# Altium schematic sheet 22.SchDoc
size 297 x 209 mm
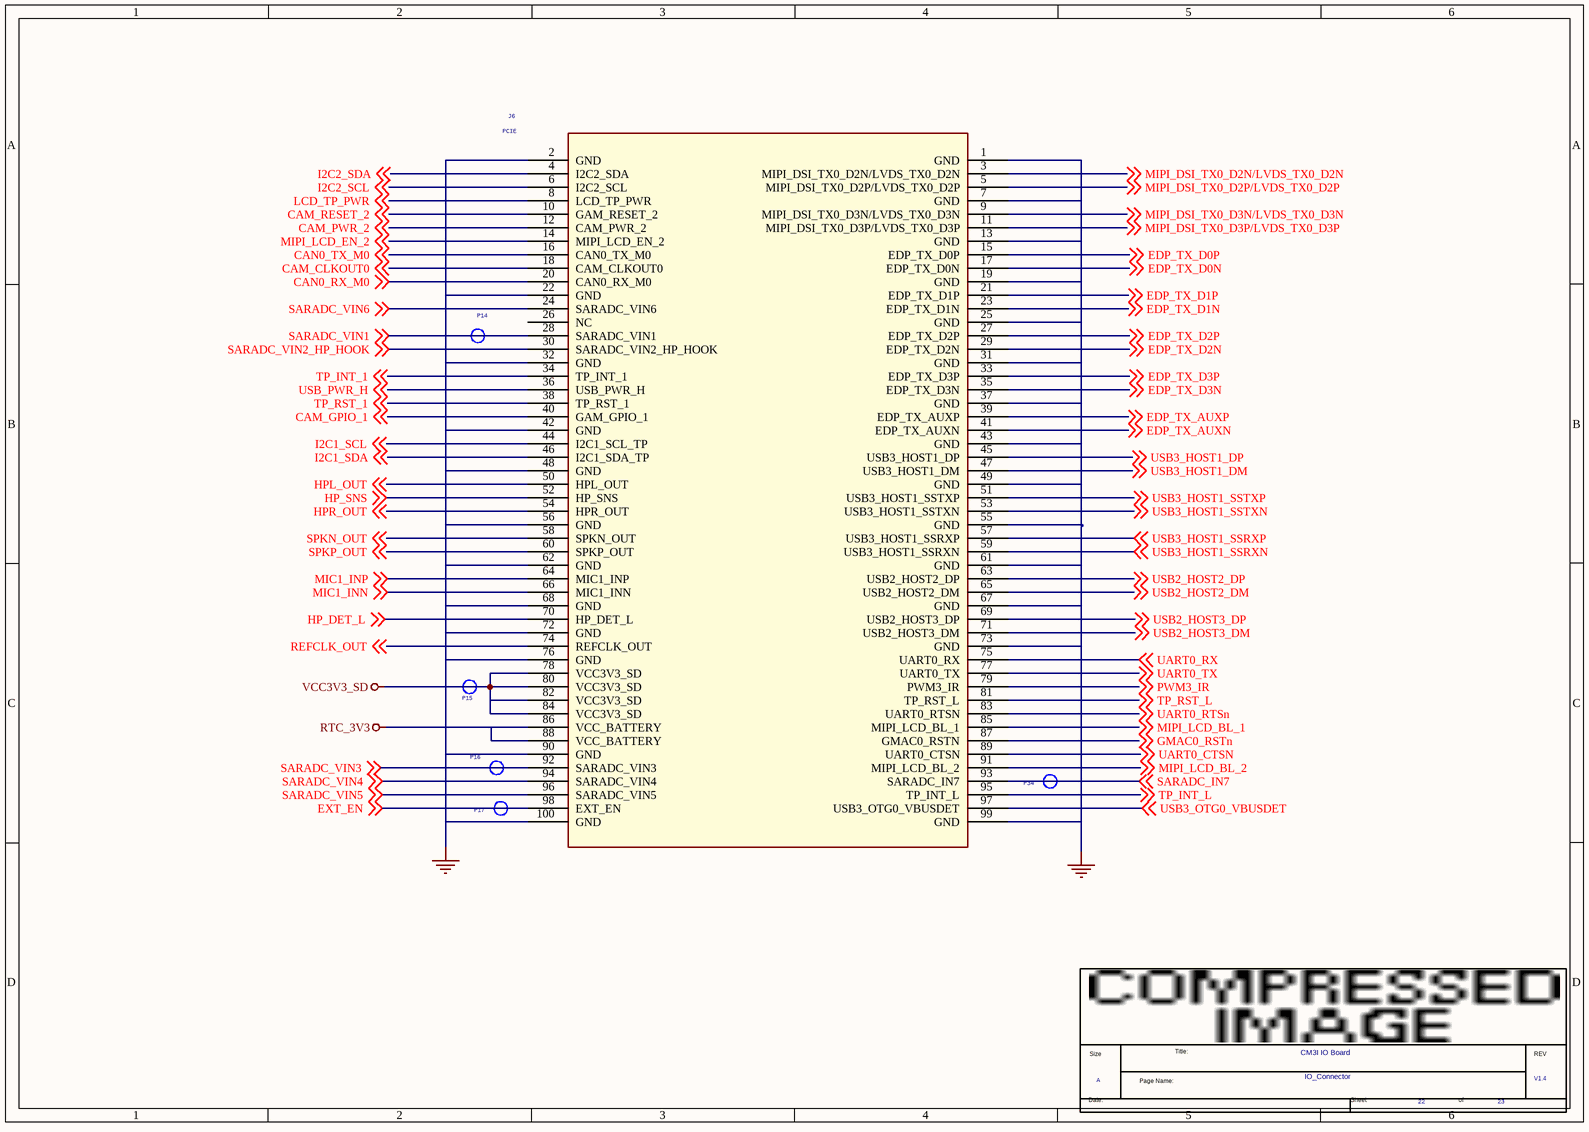
[diagram p0: 22.SchDoc]

## Parts
*  Page Count: 23  Page Number: 22  Page Size: A  Title: CM3I IO Board  RevCode: V1.4  Doc: IO_Connector  (hidden comment: radxa_1010)  (graphical)
J6  PCIE  [DF40C_100DS]
P14  TEST  [TEST]  (value not drawn)
P15  TEST  [TEST]  (value not drawn)
P16  TEST  [TEST]  (value not drawn)
P17  TEST  [TEST]  (value not drawn)
P34  TEST  [TEST]  (value not drawn)

## Nets
GND: J6.1(GND) J6.2(GND) J6.7(GND) J6.13(GND) J6.19(GND) J6.22(GND) J6.25(GND) J6.31(GND) J6.32(GND) J6.37(GND) J6.42(GND) J6.43(GND) J6.48(GND) J6.49(GND) J6.55(GND) J6.56(GND) J6.61(GND) J6.62(GND) J6.67(GND) J6.68(GND) J6.72(GND) J6.73(GND) J6.76(GND) J6.90(GND) J6.99(GND) J6.100(GND)
RTC_3V3: J6.86(VCC_BATTERY) J6.88(VCC_BATTERY)
VCC3V3_SD: J6.78(VCC3V3_SD) J6.80(VCC3V3_SD) J6.82(VCC3V3_SD) J6.84(VCC3V3_SD) P15.1
CAM_CLKOUT0: J6.18(CAM_CLKOUT0) ; off-sheet CAM_CLKOUT0
CAM_GPIO_1: J6.40(GAM_GPIO_1) ; off-sheet CAM_GPIO_1
CAM_PWR_2: J6.12(CAM_PWR_2) ; off-sheet CAM_PWR_2
CAM_RESET_2: J6.10(GAM_RESET_2) ; off-sheet CAM_RESET_2
CAN0_RX_M0: J6.20(CAN0_RX_M0) ; off-sheet CAN0_RX_M0
CAN0_TX_M0: J6.16(CAN0_TX_M0) ; off-sheet CAN0_TX_M0
EDP_TX_AUXN: J6.41(EDP_TX_AUXN) ; off-sheet EDP_TX_AUXN
EDP_TX_AUXP: J6.39(EDP_TX_AUXP) ; off-sheet EDP_TX_AUXP
EDP_TX_D0N: J6.17(EDP_TX_D0N) ; off-sheet EDP_TX_D0N
EDP_TX_D0P: J6.15(EDP_TX_D0P) ; off-sheet EDP_TX_D0P
EDP_TX_D1N: J6.23(EDP_TX_D1N) ; off-sheet EDP_TX_D1N
EDP_TX_D1P: J6.21(EDP_TX_D1P) ; off-sheet EDP_TX_D1P
EDP_TX_D2N: J6.29(EDP_TX_D2N) ; off-sheet EDP_TX_D2N
EDP_TX_D2P: J6.27(EDP_TX_D2P) ; off-sheet EDP_TX_D2P
EDP_TX_D3N: J6.35(EDP_TX_D3N) ; off-sheet EDP_TX_D3N
EDP_TX_D3P: J6.33(EDP_TX_D3P) ; off-sheet EDP_TX_D3P
EXT_EN: J6.98(EXT_EN) P17.1 ; off-sheet EXT_EN
GMAC0_RSTn: J6.87(GMAC0_RSTN) ; off-sheet GMAC0_RSTn
HP_DET_L: J6.70(HP_DET_L) ; off-sheet HP_DET_L
HP_SNS: J6.52(HP_SNS) ; off-sheet HP_SNS
HPL_OUT: J6.50(HPL_OUT) ; off-sheet HPL_OUT
HPR_OUT: J6.54(HPR_OUT) ; off-sheet HPR_OUT
I2C1_SCL: J6.44(I2C1_SCL_TP) ; off-sheet I2C1_SCL
I2C1_SDA: J6.46(I2C1_SDA_TP) ; off-sheet I2C1_SDA
I2C2_SCL: J6.6(I2C2_SCL) ; off-sheet I2C2_SCL
I2C2_SDA: J6.4(I2C2_SDA) ; off-sheet I2C2_SDA
LCD_TP_PWR: J6.8(LCD_TP_PWR) ; off-sheet LCD_TP_PWR
MIC1_INN: J6.66(MIC1_INN) ; off-sheet MIC1_INN
MIC1_INP: J6.64(MIC1_INP) ; off-sheet MIC1_INP
MIPI_DSI_TX0_D2N/LVDS_TX0_D2N: J6.3(MIPI_DSI_TX0_D2N/LVDS_TX0_D2N) ; off-sheet MIPI_DSI_TX0_D2N/LVDS_TX0_D2N
MIPI_DSI_TX0_D2P/LVDS_TX0_D2P: J6.5(MIPI_DSI_TX0_D2P/LVDS_TX0_D2P) ; off-sheet MIPI_DSI_TX0_D2P/LVDS_TX0_D2P
MIPI_DSI_TX0_D3N/LVDS_TX0_D3N: J6.9(MIPI_DSI_TX0_D3N/LVDS_TX0_D3N) ; off-sheet MIPI_DSI_TX0_D3N/LVDS_TX0_D3N
MIPI_DSI_TX0_D3P/LVDS_TX0_D3P: J6.11(MIPI_DSI_TX0_D3P/LVDS_TX0_D3P) ; off-sheet MIPI_DSI_TX0_D3P/LVDS_TX0_D3P
MIPI_LCD_BL_1: J6.85(MIPI_LCD_BL_1) ; off-sheet MIPI_LCD_BL_1
MIPI_LCD_BL_2: J6.91(MIPI_LCD_BL_2) ; off-sheet MIPI_LCD_BL_2
MIPI_LCD_EN_2: J6.14(MIPI_LCD_EN_2) ; off-sheet MIPI_LCD_EN_2
PWM3_IR: J6.79(PWM3_IR) ; off-sheet PWM3_IR
REFCLK_OUT: J6.74(REFCLK_OUT) ; off-sheet REFCLK_OUT
SARADC_IN7: J6.93(SARADC_IN7) P34.1 ; off-sheet SARADC_IN7
SARADC_VIN1: J6.28(SARADC_VIN1) P14.1 ; off-sheet SARADC_VIN1
SARADC_VIN2_HP_HOOK: J6.30(SARADC_VIN2_HP_HOOK) ; off-sheet SARADC_VIN2_HP_HOOK
SARADC_VIN3: J6.92(SARADC_VIN3) P16.1 ; off-sheet SARADC_VIN3
SARADC_VIN4: J6.94(SARADC_VIN4) ; off-sheet SARADC_VIN4
SARADC_VIN5: J6.96(SARADC_VIN5) ; off-sheet SARADC_VIN5
SARADC_VIN6: J6.24(SARADC_VIN6) ; off-sheet SARADC_VIN6
SPKN_OUT: J6.58(SPKN_OUT) ; off-sheet SPKN_OUT
SPKP_OUT: J6.60(SPKP_OUT) ; off-sheet SPKP_OUT
TP_INT_1: J6.34(TP_INT_1) ; off-sheet TP_INT_1
TP_INT_L: J6.95(TP_INT_L) ; off-sheet TP_INT_L
TP_RST_1: J6.38(TP_RST_1) ; off-sheet TP_RST_1
TP_RST_L: J6.81(TP_RST_L) ; off-sheet TP_RST_L
UART0_CTSN: J6.89(UART0_CTSN) ; off-sheet UART0_CTSN
UART0_RTSn: J6.83(UART0_RTSN) ; off-sheet UART0_RTSn
UART0_RX: J6.75(UART0_RX) ; off-sheet UART0_RX
UART0_TX: J6.77(UART0_TX) ; off-sheet UART0_TX
USB2_HOST2_DM: J6.65(USB2_HOST2_DM) ; off-sheet USB2_HOST2_DM
USB2_HOST2_DP: J6.63(USB2_HOST2_DP) ; off-sheet USB2_HOST2_DP
USB2_HOST3_DM: J6.71(USB2_HOST3_DM) ; off-sheet USB2_HOST3_DM
USB2_HOST3_DP: J6.69(USB2_HOST3_DP) ; off-sheet USB2_HOST3_DP
USB3_HOST1_DM: J6.47(USB3_HOST1_DM) ; off-sheet USB3_HOST1_DM
USB3_HOST1_DP: J6.45(USB3_HOST1_DP) ; off-sheet USB3_HOST1_DP
USB3_HOST1_SSRXN: J6.59(USB3_HOST1_SSRXN) ; off-sheet USB3_HOST1_SSRXN
USB3_HOST1_SSRXP: J6.57(USB3_HOST1_SSRXP) ; off-sheet USB3_HOST1_SSRXP
USB3_HOST1_SSTXN: J6.53(USB3_HOST1_SSTXN) ; off-sheet USB3_HOST1_SSTXN
USB3_HOST1_SSTXP: J6.51(USB3_HOST1_SSTXP) ; off-sheet USB3_HOST1_SSTXP
USB3_OTG0_VBUSDET: J6.97(USB3_OTG0_VBUSDET) ; off-sheet USB3_OTG0_VBUSDET
USB_PWR_H: J6.36(USB_PWR_H) ; off-sheet USB_PWR_H

Not connected (* = marked no-connect by the designer): J6 26(NC)

## Notes on the sheet
- (in symbol radxa_1010) Title:; Size; REV; Page Name:; Date:; Sheet; of

## Library data of the parts
J6 = CN_9
P14-P17 P34 = TESTPOINT1
* = radxa_1010: Page Create Date: March  8, 1995